# EAGLE schematic display_board (EAGLE 9.6.0)
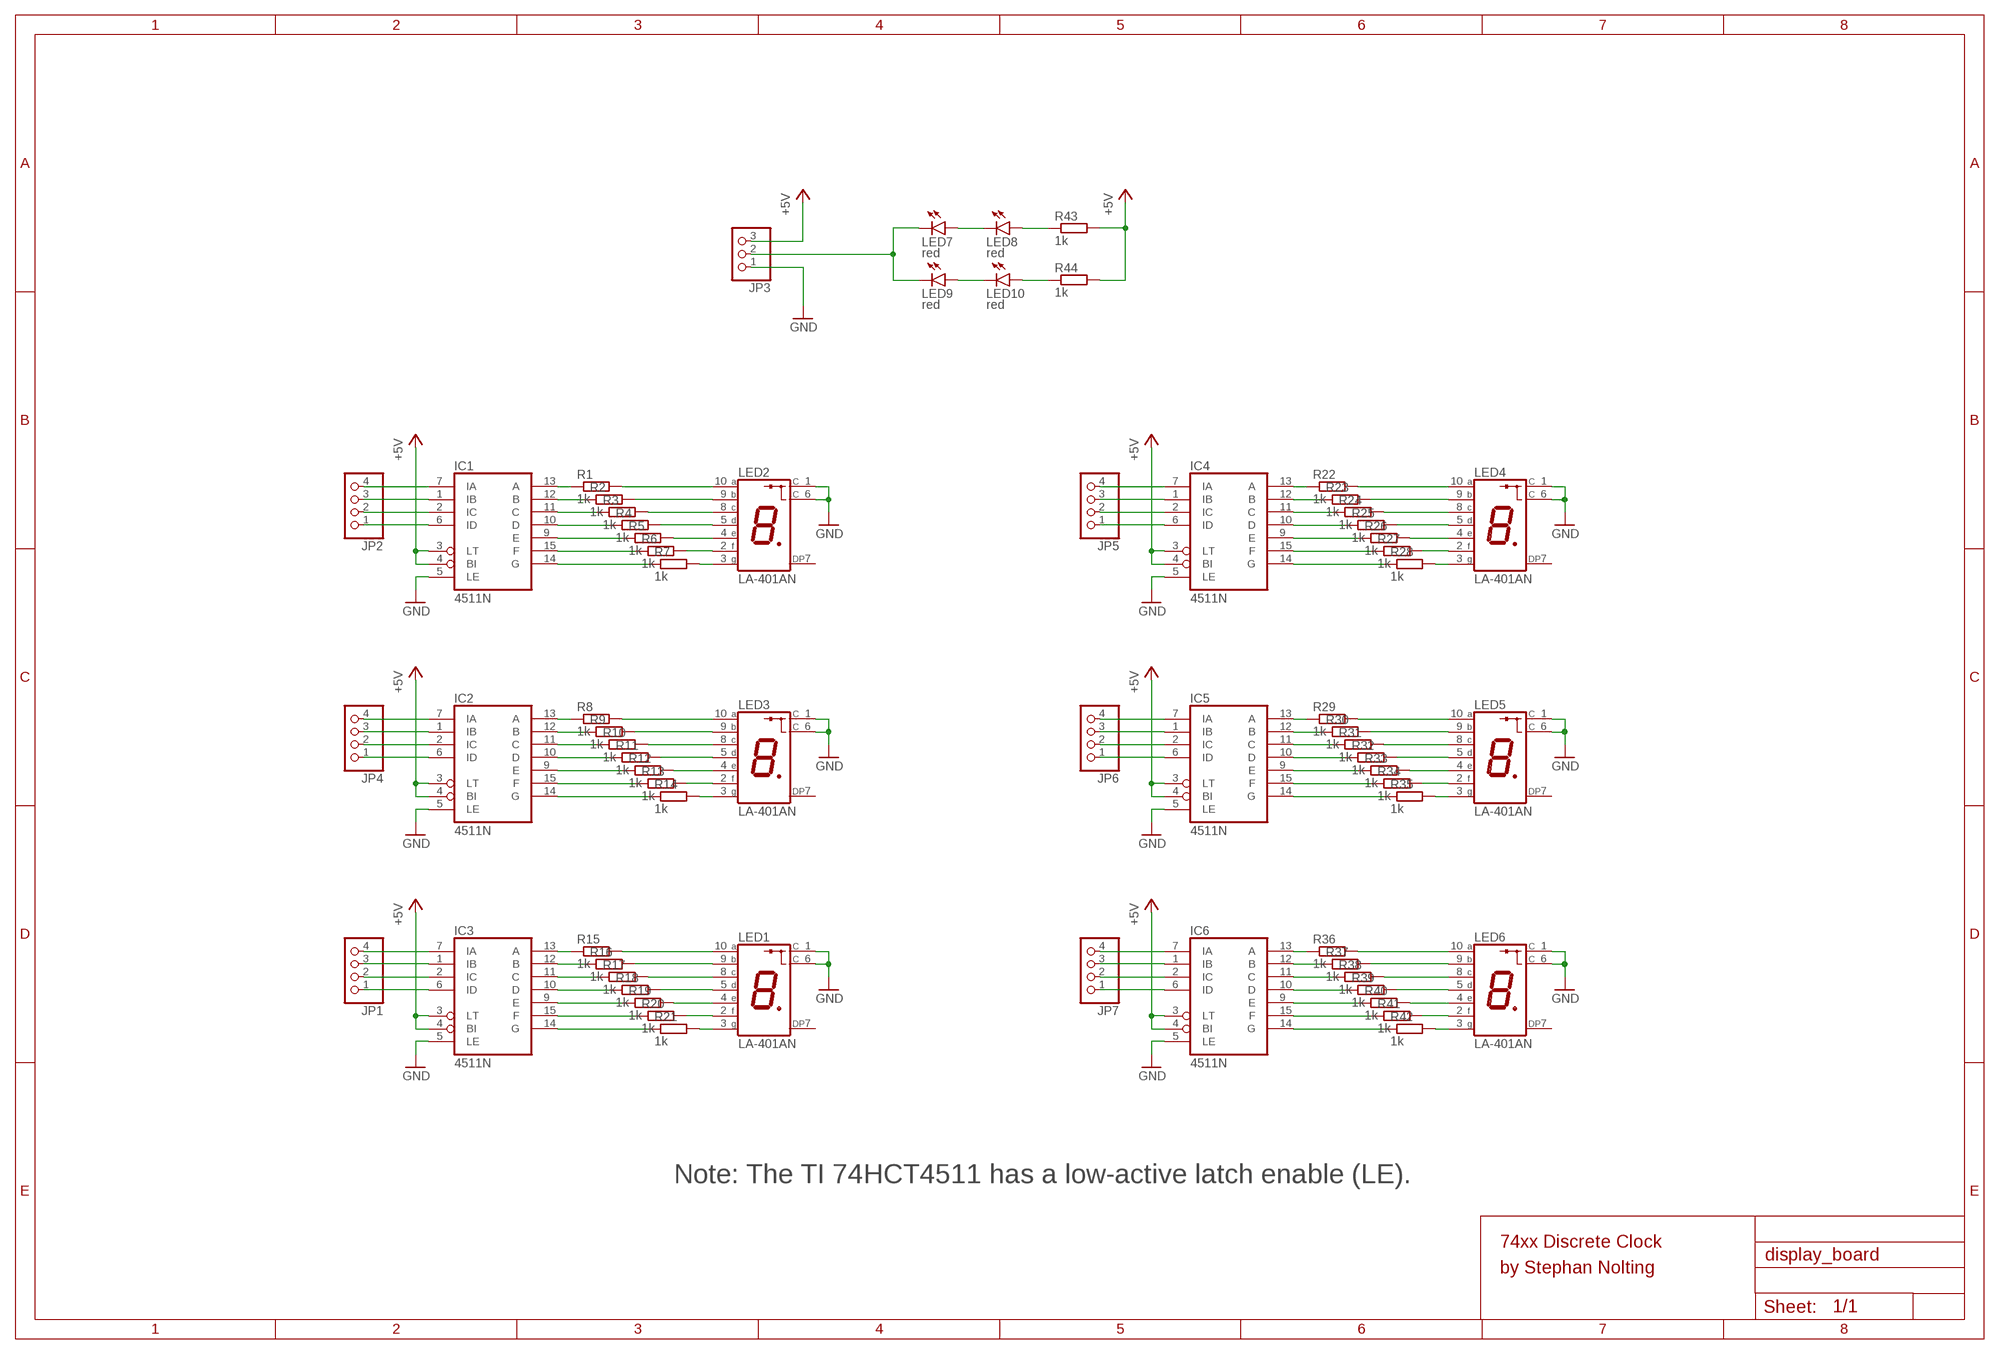
[diagram p0: schematic, sheet 1]

## Parts
IC1  4511N  [DIL16]
IC2  4511N  [DIL16]
IC3  4511N  [DIL16]
IC4  4511N  [DIL16]
IC5  4511N  [DIL16]
IC6  4511N  [DIL16]
JP1  PINHD-1X4  [1X04]
JP2  PINHD-1X4  [1X04]
JP3  PINHD-1X3  [1X03]
JP4  PINHD-1X4  [1X04]
JP5  PINHD-1X4  [1X04]
JP6  PINHD-1X4  [1X04]
JP7  PINHD-1X4  [1X04]
LED1  LA-401AN  [LA-401]
LED2  LA-401AN  [LA-401]
LED3  LA-401AN  [LA-401]
LED4  LA-401AN  [LA-401]
LED5  LA-401AN  [LA-401]
LED6  LA-401AN  [LA-401]
LED7  red  LED3MM  [LED3MM]
LED8  red  LED3MM  [LED3MM]
LED9  red  LED3MM  [LED3MM]
LED10  red  LED3MM  [LED3MM]
R1  1k  R-EU_0204/7  [0204/7]
R2  1k  R-EU_0204/7  [0204/7]
R3  1k  R-EU_0204/7  [0204/7]
R4  1k  R-EU_0204/7  [0204/7]
R5  1k  R-EU_0204/7  [0204/7]
R6  1k  R-EU_0204/7  [0204/7]
R7  1k  R-EU_0204/7  [0204/7]
R8  1k  R-EU_0204/7  [0204/7]
R9  1k  R-EU_0204/7  [0204/7]
R10  1k  R-EU_0204/7  [0204/7]
R11  1k  R-EU_0204/7  [0204/7]
R12  1k  R-EU_0204/7  [0204/7]
R13  1k  R-EU_0204/7  [0204/7]
R14  1k  R-EU_0204/7  [0204/7]
R15  1k  R-EU_0204/7  [0204/7]
R16  1k  R-EU_0204/7  [0204/7]
R17  1k  R-EU_0204/7  [0204/7]
R18  1k  R-EU_0204/7  [0204/7]
R19  1k  R-EU_0204/7  [0204/7]
R20  1k  R-EU_0204/7  [0204/7]
R21  1k  R-EU_0204/7  [0204/7]
R22  1k  R-EU_0204/7  [0204/7]
R23  1k  R-EU_0204/7  [0204/7]
R24  1k  R-EU_0204/7  [0204/7]
R25  1k  R-EU_0204/7  [0204/7]
R26  1k  R-EU_0204/7  [0204/7]
R27  1k  R-EU_0204/7  [0204/7]
R28  1k  R-EU_0204/7  [0204/7]
R29  1k  R-EU_0204/7  [0204/7]
R30  1k  R-EU_0204/7  [0204/7]
R31  1k  R-EU_0204/7  [0204/7]
R32  1k  R-EU_0204/7  [0204/7]
R33  1k  R-EU_0204/7  [0204/7]
R34  1k  R-EU_0204/7  [0204/7]
R35  1k  R-EU_0204/7  [0204/7]
R36  1k  R-EU_0204/7  [0204/7]
R37  1k  R-EU_0204/7  [0204/7]
R38  1k  R-EU_0204/7  [0204/7]
R39  1k  R-EU_0204/7  [0204/7]
R40  1k  R-EU_0204/7  [0204/7]
R41  1k  R-EU_0204/7  [0204/7]
R42  1k  R-EU_0204/7  [0204/7]
R43  1k  R-EU_0204/7  [0204/7]
R44  1k  R-EU_0204/7  [0204/7]

## Nets
+5V: IC1.3(LT) IC1.4(BI) IC2.3(LT) IC2.4(BI) IC3.3(LT) IC3.4(BI) IC4.3(LT) IC4.4(BI) IC5.3(LT) IC5.4(BI) IC6.3(LT) IC6.4(BI) JP3.3 R43.2 R44.2
GND: IC1.5(LE) IC2.5(LE) IC3.5(LE) IC4.5(LE) IC5.5(LE) IC6.5(LE) JP3.1 LED1.1(C) LED1.6(C) LED2.1(C) LED2.6(C) LED3.1(C) LED3.6(C) LED4.1(C) LED4.6(C) LED5.1(C) LED5.6(C) LED6.1(C) LED6.6(C)
N$1: IC3.13(A) R15.1
N$2: IC3.12(B) R16.1
N$3: IC1.13(A) R1.1
N$4: IC1.12(B) R2.1
N$5: IC1.11(C) R3.1
N$6: IC1.10(D) R4.1
N$7: IC1.9(E) R5.1
N$8: IC1.15(F) R6.1
N$9: IC1.14(G) R7.1
N$10: LED2.10(A) R1.2
N$11: LED2.9(B) R2.2
N$12: LED2.8(C) R3.2
N$13: LED2.5(D) R4.2
N$14: LED2.4(E) R5.2
N$15: LED2.2(F) R6.2
N$16: LED2.3(G) R7.2
N$17: IC1.7(IA) JP2.4
N$18: IC1.1(IB) JP2.3
N$19: IC1.2(IC) JP2.2
N$20: IC1.6(ID) JP2.1
N$21: IC2.13(A) R8.1
N$22: IC2.12(B) R9.1
N$23: IC2.11(C) R10.1
N$24: IC2.10(D) R11.1
N$25: IC2.9(E) R12.1
N$26: IC2.15(F) R13.1
N$27: IC2.14(G) R14.1
N$28: LED3.10(A) R8.2
N$29: LED3.9(B) R9.2
N$30: LED3.8(C) R10.2
N$31: LED3.5(D) R11.2
N$32: LED3.4(E) R12.2
N$33: LED3.2(F) R13.2
N$34: LED3.3(G) R14.2
N$35: IC2.7(IA) JP4.4
N$36: IC2.1(IB) JP4.3
N$37: IC2.2(IC) JP4.2
N$38: IC2.6(ID) JP4.1
N$39: IC3.11(C) R17.1
N$40: IC3.10(D) R18.1
N$41: IC3.9(E) R19.1
N$42: IC3.15(F) R20.1
N$43: IC3.14(G) R21.1
N$44: LED1.10(A) R15.2
N$45: LED1.9(B) R16.2
N$46: LED1.8(C) R17.2
N$47: LED1.5(D) R18.2
N$48: LED1.4(E) R19.2
N$49: LED1.2(F) R20.2
N$50: LED1.3(G) R21.2
N$51: IC3.7(IA) JP1.4
N$52: IC3.1(IB) JP1.3
N$53: IC3.2(IC) JP1.2
N$54: IC3.6(ID) JP1.1
N$55: IC4.13(A) R22.1
N$56: IC4.12(B) R23.1
N$57: IC4.11(C) R24.1
N$58: IC4.10(D) R25.1
N$59: IC4.9(E) R26.1
N$60: IC4.15(F) R27.1
N$61: IC4.14(G) R28.1
N$62: LED4.10(A) R22.2
N$63: LED4.9(B) R23.2
N$64: LED4.8(C) R24.2
N$65: LED4.5(D) R25.2
N$66: LED4.4(E) R26.2
N$67: LED4.2(F) R27.2
N$68: LED4.3(G) R28.2
N$69: IC4.7(IA) JP5.4
N$70: IC4.1(IB) JP5.3
N$71: IC4.2(IC) JP5.2
N$72: IC4.6(ID) JP5.1
N$73: IC5.13(A) R29.1
N$74: IC5.12(B) R30.1
N$75: IC5.11(C) R31.1
N$76: IC5.10(D) R32.1
N$77: IC5.9(E) R33.1
N$78: IC5.15(F) R34.1
N$79: IC5.14(G) R35.1
N$80: LED5.10(A) R29.2
N$81: LED5.9(B) R30.2
N$82: LED5.8(C) R31.2
N$83: LED5.5(D) R32.2
N$84: LED5.4(E) R33.2
N$85: LED5.2(F) R34.2
N$86: LED5.3(G) R35.2
N$87: IC5.7(IA) JP6.4
N$88: IC5.1(IB) JP6.3
N$89: IC5.2(IC) JP6.2
N$90: IC5.6(ID) JP6.1
N$91: IC6.13(A) R36.1
N$92: IC6.12(B) R37.1
N$93: IC6.11(C) R38.1
N$94: IC6.10(D) R39.1
N$95: IC6.9(E) R40.1
N$96: IC6.15(F) R41.1
N$97: IC6.14(G) R42.1
N$98: LED6.10(A) R36.2
N$99: LED6.9(B) R37.2
N$100: LED6.8(C) R38.2
N$101: LED6.5(D) R39.2
N$102: LED6.4(E) R40.2
N$103: LED6.2(F) R41.2
N$104: LED6.3(G) R42.2
N$105: IC6.7(IA) JP7.4
N$106: IC6.1(IB) JP7.3
N$107: IC6.2(IC) JP7.2
N$108: IC6.6(ID) JP7.1
N$109: JP3.2 LED7.K(C) LED9.K(C)
N$110: LED7.A LED8.K(C)
N$111: LED8.A R43.1
N$112: LED9.A LED10.K(C)
N$113: LED10.A R44.1
Unconnected: LED1.7(DP) LED2.7(DP) LED3.7(DP) LED4.7(DP) LED5.7(DP) LED6.7(DP)

## Notes on the sheet
- Note: The TI 74HCT4511 has a low-active latch enable (LE).
- 74xx Discrete Clock
- by Stephan Nolting

## Power pins joined to a net without a drawn wire
VDD: IC1.16(VDD) IC2.16(VDD) IC3.16(VDD) IC4.16(VDD) IC5.16(VDD) IC6.16(VDD)
VSS: IC1.8(VSS) IC2.8(VSS) IC3.8(VSS) IC4.8(VSS) IC5.8(VSS) IC6.8(VSS)

## Library data of the parts
IC1-IC6 = 45xx:4511: BCD to 7-segment LATCH/DECODER/DRIVER
JP1 JP2 JP4-JP7 = pinhead:PINHD-1X4: PIN HEADER
JP3 = pinhead:PINHD-1X3: PIN HEADER
LED1-LED6 = led-7-segment:LA-401*N: Single Digit LED Numeric Display (cathode common) Source: ROHM .. la-1401dn.pdf; OC_FARNELL: unknown; OC_NEWARK: unknown
LED7-LED10 = led:LED: LED OSRAM: - CHIPLED LG R971, LG N971, LY N971, LG Q971, LY Q971, LO R971, LY R971 LH N974, LH R974 LS Q976, LO Q976, LY Q976 LO Q996 - Hyper CHIPLED LW Q18S LB Q993, LB Q99A, LB R99A - SideLED LS A670, LO A670, LY A670, LG A670, LP A670 LB A673, LV A673, LT A673, LW A673 LH A674 LY A675 LS A676, LA A676, LO A676, LY A676, LW A676 LS A679, LY A679, LG A679 - Hyper Micro SIDELED® LS Y876, LA Y876, LO Y876, LY Y876 LT Y87S - SmartLED LW L88C, LW L88S LB L89C, LB L89S, LG L890 LS L89K, LO L89K, LY L89K LS L896, LA L896, LO L896, LY L896 - TOPLED LS T670, LO T670, LY T670, LG T670, LP T670 LSG T670, LSP T670, LSY T670, LOP T670, LYG T670 LG T671, LOG T671, LSG T671 LB T673, LV T673, LT T673, LW T673 LH T674 LS T676, LA T676, LO T676, LY T676, LB T676, LH T676, LSB T676, LW T676 LB T67C, LV T67C, LT T67C, LS T67K, LO T67K, LY T67K, LW E67C LS E67B, LA E67B, LO E67B, LY E67B, LB E67C, LV E67C, LT E67C LW T67C LS T679, LY T679, LG T679 LS T770, LO T770, LY T770, LG T770, LP T770 LB T773, LV T773, LT T773, LW T773 LH T774 LS E675, LA E675, LY E675, LS T675 LS T776, LA T776, LO T776, LY T776, LB T776 LHGB T686 LT T68C, LB T68C - Hyper Mini TOPLED® LB M676 - Mini TOPLED Santana® LG M470 LS M47K, LO M47K, LY M47K Source: http://www.osram.convergy.de LUXEON: - LUMILED® LXK2-PW12-R00, LXK2-PW12-S00, LXK2-PW14-U00, LXK2-PW14-V00 LXK2-PM12-R00, LXK2-PM12-S00, LXK2-PM14-U00 LXK2-PE12-Q00, LXK2-PE12-R00, LXK2-PE12-S00, LXK2-PE14-T00, LXK2-PE14-U00 LXK2-PB12-K00, LXK2-PB12-L00, LXK2-PB12-M00, LXK2-PB14-N00, LXK2-PB14-P00, LXK2-PB14-Q00 LXK2-PR12-L00, LXK2-PR12-M00, LXK2-PR14-Q00, LXK2-PR14-R00 LXK2-PD12-Q00, LXK2-PD12-R00, LXK2-PD12-S00 LXK2-PH12-R00, LXK2-PH12-S00 LXK2-PL12-P00, LXK2-PL12-Q00, LXK2-PL12-R00 Source: www.luxeon.com KINGBRIGHT: KA-3528ASYC Source: www.kingbright.com
R1-R44 = rcl:R-EU_: RESISTOR, European symbol; SPICEPREFIX: R